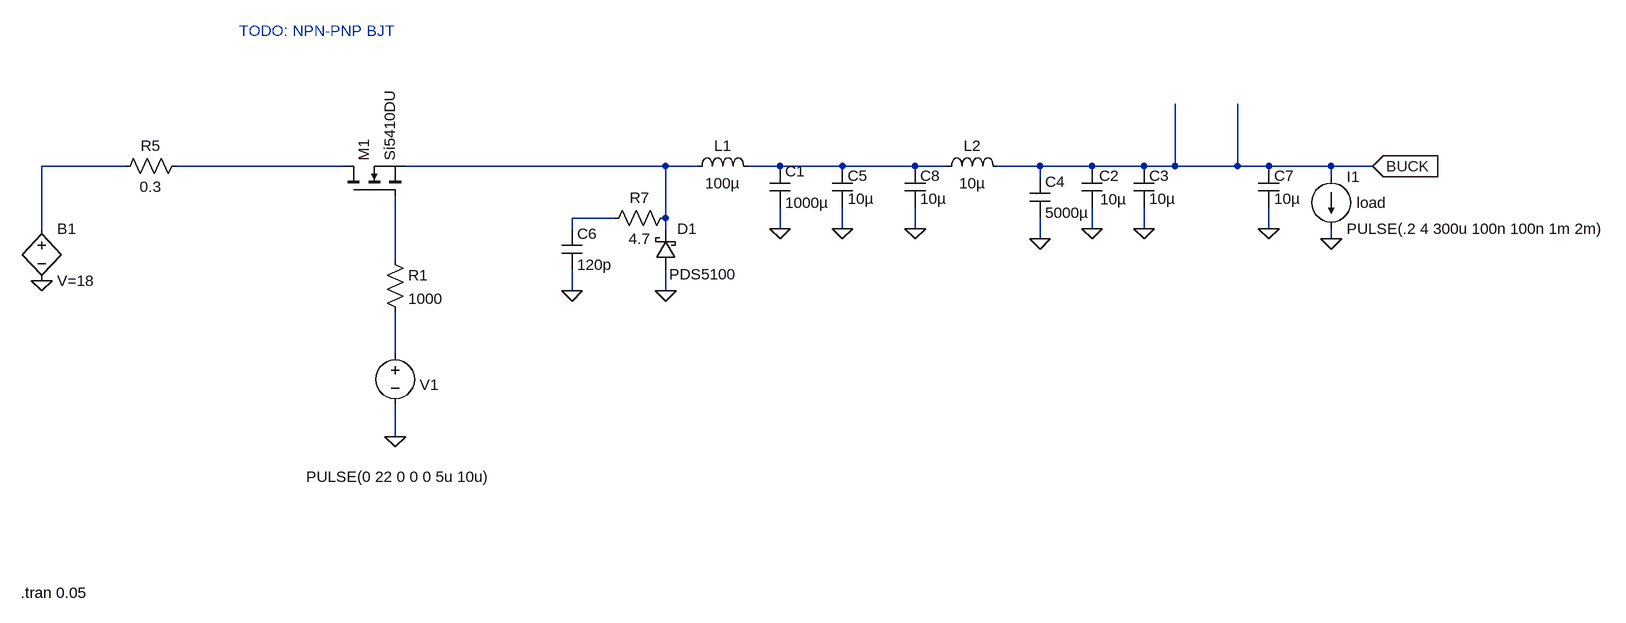
[diagram p0: schematic buck.asc]
buck.asc, the LTspice schematic file:
Version 4
SHEET 1 880 680
WIRE -54592 -2864 -54720 -2864
WIRE -54256 -2864 -54512 -2864
WIRE -53760 -2864 -54160 -2864
WIRE -53712 -2864 -53760 -2864
WIRE -53584 -2864 -53632 -2864
WIRE -53488 -2864 -53584 -2864
WIRE -53376 -2864 -53488 -2864
WIRE -53328 -2864 -53376 -2864
WIRE -53184 -2864 -53248 -2864
WIRE -53104 -2864 -53184 -2864
WIRE -53024 -2864 -53104 -2864
WIRE -52976 -2864 -52976 -2960
WIRE -52976 -2864 -53024 -2864
WIRE -52880 -2864 -52880 -2960
WIRE -52880 -2864 -52976 -2864
WIRE -52832 -2864 -52880 -2864
WIRE -52736 -2864 -52832 -2864
WIRE -52672 -2864 -52736 -2864
WIRE -53184 -2848 -53184 -2864
WIRE -52736 -2848 -52736 -2864
WIRE -53840 -2784 -53904 -2784
WIRE -53760 -2784 -53760 -2864
WIRE -54720 -2768 -54720 -2864
WIRE -53904 -2768 -53904 -2784
WIRE -53760 -2768 -53760 -2784
WIRE -53584 -2768 -53584 -2800
WIRE -53488 -2768 -53488 -2800
WIRE -53376 -2768 -53376 -2800
WIRE -53104 -2768 -53104 -2800
WIRE -53024 -2768 -53024 -2800
WIRE -52832 -2768 -52832 -2800
WIRE -53184 -2752 -53184 -2784
WIRE -52736 -2752 -52736 -2768
WIRE -54176 -2720 -54176 -2816
WIRE -53904 -2672 -53904 -2704
WIRE -53760 -2672 -53760 -2704
WIRE -54176 -2576 -54176 -2640
WIRE -54176 -2448 -54176 -2496
FLAG -54176 -2448 0
FLAG -53584 -2768 0
FLAG -53104 -2768 0
FLAG -53024 -2768 0
FLAG -52672 -2864 BUCK
IOPIN -52672 -2864 In
FLAG -53184 -2752 0
FLAG -53760 -2672 0
FLAG -53488 -2768 0
FLAG -54720 -2688 0
FLAG -53904 -2672 0
FLAG -52736 -2752 0
FLAG -52832 -2768 0
FLAG -53376 -2768 0
SYMBOL voltage -54176 -2592 R0
WINDOW 3 -137 206 Left 2
WINDOW 123 39 113 Left 2
WINDOW 39 0 0 Left 2
WINDOW 0 38 64 Left 2
SYMATTR Value PULSE(0 22 0 0 0 5u 10u)
SYMATTR InstName V1
SYMBOL ind -53728 -2848 R270
WINDOW 0 32 56 VTop 2
WINDOW 3 5 56 VBottom 2
SYMATTR InstName L1
SYMATTR Value 100µ
SYMATTR SpiceLine Rser=0.11
SYMBOL cap -53600 -2864 R0
SYMATTR InstName C1
SYMATTR Value 1000µ
SYMATTR SpiceLine Rser=0.05
SYMBOL cap -53120 -2864 R0
WINDOW 0 27 15 Left 2
WINDOW 3 29 51 Left 2
SYMATTR InstName C2
SYMATTR Value 10µ
SYMATTR SpiceLine Rser=0.004
SYMBOL cap -53040 -2864 R0
WINDOW 0 24 15 Left 2
WINDOW 3 24 50 Left 2
SYMATTR InstName C3
SYMATTR Value 10µ
SYMATTR SpiceLine Rser=0.004
SYMBOL ind -53344 -2848 R270
WINDOW 0 32 56 VTop 2
WINDOW 3 5 56 VBottom 2
SYMATTR InstName L2
SYMATTR Value 10µ
SYMATTR SpiceLine Rser=0.05
SYMBOL cap -53200 -2848 R0
SYMATTR InstName C4
SYMATTR Value 5000µ
SYMATTR SpiceLine Rser=0.05
SYMBOL res -54192 -2736 R0
SYMATTR InstName R1
SYMATTR Value 1000
SYMBOL nmos -54256 -2816 R270
SYMATTR InstName M1
SYMATTR Value Si5410DU
SYMBOL schottky -53744 -2704 R180
WINDOW 0 -33 64 Left 2
WINDOW 3 -92 -6 Left 2
SYMATTR InstName D1
SYMATTR Value PDS5100
SYMATTR Description Diode
SYMATTR Type diode
SYMBOL cap -53504 -2864 R0
WINDOW 0 24 15 Left 2
WINDOW 3 24 50 Left 2
SYMATTR InstName C5
SYMATTR Value 10µ
SYMATTR SpiceLine Rser=0.004
SYMBOL bv -54720 -2784 R0
SYMATTR InstName B1
SYMATTR Value V=18
SYMBOL res -54496 -2880 R90
WINDOW 0 0 56 VBottom 2
WINDOW 3 32 56 VTop 2
SYMATTR InstName R5
SYMATTR Value 0.3
SYMBOL cap -53920 -2768 R0
SYMATTR InstName C6
SYMATTR Value 120p
SYMBOL res -53744 -2800 R90
WINDOW 0 0 56 VBottom 2
WINDOW 3 32 56 VTop 2
SYMATTR InstName R7
SYMATTR Value 4.7
SYMBOL current -52736 -2848 R0
WINDOW 123 0 0 Left 2
WINDOW 39 39 40 Left 2
SYMATTR SpiceLine load
SYMATTR InstName I1
SYMATTR Value PULSE(.2 4 300u 100n 100n 1m 2m)
SYMBOL cap -52848 -2864 R0
WINDOW 0 24 15 Left 2
WINDOW 3 24 50 Left 2
SYMATTR InstName C7
SYMATTR Value 10µ
SYMATTR SpiceLine Rser=0.004
SYMBOL cap -53392 -2864 R0
WINDOW 0 24 15 Left 2
WINDOW 3 24 50 Left 2
SYMATTR InstName C8
SYMATTR Value 10µ
SYMATTR SpiceLine Rser=0.004
TEXT -54416 -3072 Left 2 ;TODO: NPN-PNP BJT
TEXT -54752 -2208 Left 2 !.tran 0.05

The netlist it stands for:
* buck.asc
V1 N007 0 PULSE(0 22 0 0 0 5u 10u)
L1 N003 N004 100µ Rser=0.11
C1 N004 0 1000µ Rser=0.05
C2 BUCK 0 10µ Rser=0.004
C3 BUCK 0 10µ Rser=0.004
L2 N004 BUCK 10µ Rser=0.05
C4 BUCK 0 5000µ Rser=0.05
R1 N006 N007 1000
M1 N002 N006 N003 N003 Si5410DU
D1 0 N003 PDS5100
C5 N004 0 10µ Rser=0.004
B1 N001 0 V=18
R5 N002 N001 0.3
C6 N005 0 120p
R7 N003 N005 4.7
I1 BUCK 0 PULSE(.2 4 300u 100n 100n 1m 2m) load
C7 BUCK 0 10µ Rser=0.004
C8 N004 0 10µ Rser=0.004
.model D D
.lib standard.dio
.model NMOS NMOS
.model PMOS PMOS
.lib standard.mos
* TODO: NPN-PNP BJT
.tran 0.05
.backanno
.end